# Altium schematic sheet DC_DRIVERS.SchDoc
size A4; SheetNumber: 2; SheetTotal: 7
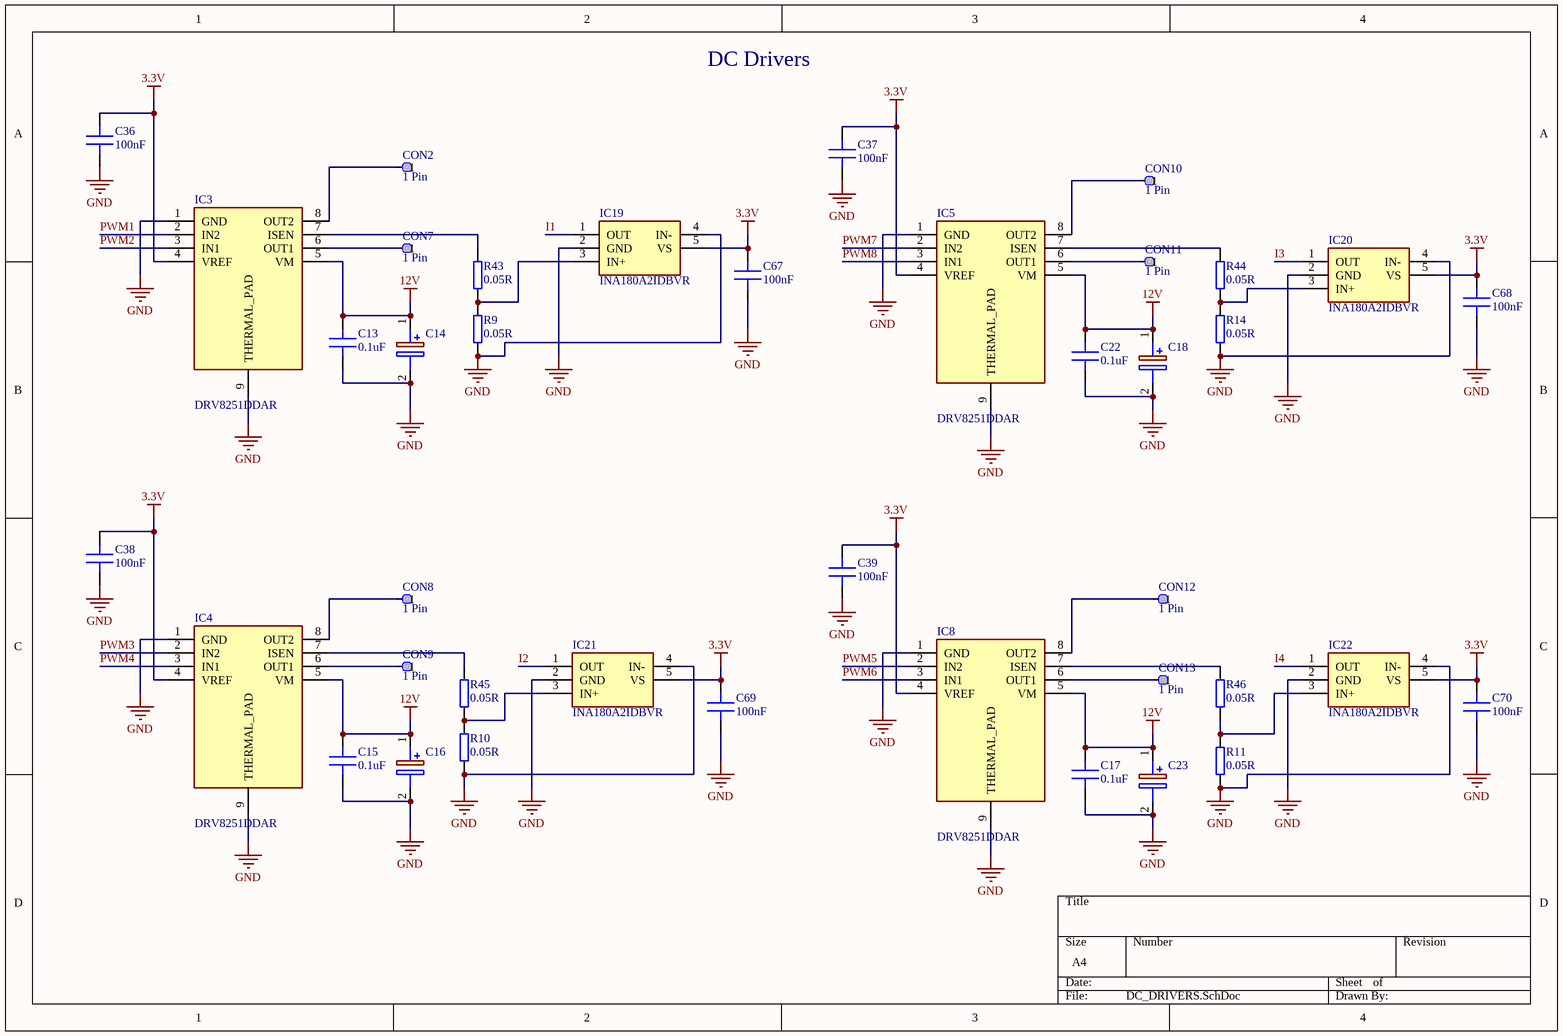
[diagram p0: DC_DRIVERS.SchDoc]

## Parts
C13  0.1uF  [C 0402]
C14  UVY1V101MED1TD  [CAPPRD250W50D655H1250]  (value not drawn)
C15  0.1uF  [C 0603]
C16  UVY1V101MED1TD  [CAPPRD250W50D655H1250]  (value not drawn)
C17  0.1uF  [C 0402]
C18  UVY1V101MED1TD  [CAPPRD250W50D655H1250]  (value not drawn)
C22  0.1uF  [C 0402]
C23  UVY1V101MED1TD  [CAPPRD250W50D655H1250]  (value not drawn)
C36  100nF  [C 0402]
C37  100nF  [C 0402]
C38  100nF  [C 0402]
C39  100nF  [C 0402]
C67  100nF  [C 0402]
C68  100nF  [C 0402]
C69  100nF  [C 0402]
C70  100nF  [C 0402]
CON2  1 Pin  [SMD PAD]
CON7  1 Pin  [SMD PAD]
CON8  1 Pin  [SMD PAD]
CON9  1 Pin  [SMD PAD]
CON10  1 Pin  [SMD PAD]
CON11  1 Pin  [SMD PAD]
CON12  1 Pin  [SMD PAD]
CON13  1 Pin  [SMD PAD]
IC3  DRV8251DDAR  [SOIC127P600X170-9N]
IC4  DRV8251DDAR  [SOIC127P600X170-9N]
IC5  DRV8251DDAR  [SOIC127P600X170-9N]
IC8  DRV8251DDAR  [SOIC127P600X170-9N]
IC19  INA180A2IDBVR  [SOT95P280X145-5N]
IC20  INA180A2IDBVR  [SOT95P280X145-5N]
IC21  INA180A2IDBVR  [SOT95P280X145-5N]
IC22  INA180A2IDBVR  [SOT95P280X145-5N]
R9  0.05R  [R 1206]
R10  0.05R  [R 1206]
R11  0.05R  [R 1206]
R14  0.05R  [R 1206]
R43  0.05R  [R 1206]
R44  0.05R  [R 1206]
R45  0.05R  [R 1206]
R46  0.05R  [R 1206]

## Nets
3.3V: C36.1 C37.1 C38.1 C39.1 C67.1 C68.1 C69.1 C70.1 IC3.4(VREF) IC4.4(VREF) IC5.4(VREF) IC8.4(VREF) IC19.5(VS) IC20.5(VS) IC21.5(VS) IC22.5(VS)
12V: C13.1 C14.1(+) C15.1 C16.1(+) C17.1 C18.1(+) C22.1 C23.1(+) IC3.5(VM) IC4.5(VM) IC5.5(VM) IC8.5(VM)
GND: C13.2 C14.2(-) C15.2 C16.2(-) C17.2 C18.2(-) C22.2 C23.2(-) C36.2 C37.2 C38.2 C39.2 C67.2 C68.2 C69.2 C70.2 IC3.1(GND) IC3.9(THERMAL_PAD) IC4.1(GND) IC4.9(THERMAL_PAD) IC5.1(GND) IC5.9(THERMAL_PAD) IC8.1(GND) IC8.9(THERMAL_PAD) IC19.2(GND) IC19.4(IN-) IC20.2(GND) IC20.4(IN-) IC21.2(GND) IC21.4(IN-) IC22.2(GND) IC22.4(IN-) R9.2 R10.2 R11.2 R14.2
I1: IC19.1(OUT)
I2: IC21.1(OUT)
I3: IC20.1(OUT)
I4: IC22.1(OUT)
PWM1: IC3.2(IN2)
PWM2: IC3.3(IN1)
PWM3: IC4.2(IN2)
PWM4: IC4.3(IN1)
PWM5: IC8.2(IN2)
PWM6: IC8.3(IN1)
PWM7: IC5.2(IN2)
PWM8: IC5.3(IN1)
NetCON2_1: CON2.1 IC3.8(OUT2)
NetCON7_1: CON7.1 IC3.6(OUT1)
NetCON8_1: CON8.1 IC4.8(OUT2)
NetCON9_1: CON9.1 IC4.6(OUT1)
NetCON10_1: CON10.1 IC5.8(OUT2)
NetCON11_1: CON11.1 IC5.6(OUT1)
NetCON12_1: CON12.1 IC8.8(OUT2)
NetCON13_1: CON13.1 IC8.6(OUT1)
NetIC3_7: IC3.7(ISEN) R43.1
NetIC4_7: IC4.7(ISEN) R45.1
NetIC5_7: IC5.7(ISEN) R44.1
NetIC8_7: IC8.7(ISEN) R46.1
NetIC19_3: IC19.3(IN+) R9.1 R43.2
NetIC20_3: IC20.3(IN+) R14.1 R44.2
NetIC21_3: IC21.3(IN+) R10.1 R45.2
NetIC22_3: IC22.3(IN+) R11.1 R46.2

## Notes on the sheet
- DC Drivers

## Library data of the parts
C13 C15 C17 C22 C36-C39 C67-C70 = Capacitor: MLCC Capacitor
C14 C16 C18 C23 = UVY1V101MED1TD: Capacitor Polarised; Manufacturer_Name: Nichicon; Datasheet Link: http://nichicon-us.com/english/products/pdfs/e-uvy.pdf; Height: 12.5mm; Manufacturer_Part_Number: UVY1V101MED1TD; Arrow Part Number: UVY1V101MED1TD; Arrow Price/Stock: https://www.arrow.com/en/products/uvy1v101med1td/nichicon
IC3-IC5 IC8 = DRV8251DDAR: Integrated Circuit; Manufacturer_Name: Texas Instruments; Datasheet Link: https://www.arrow.com/en/products/drv8251ddar/texas-instruments?region=nac; Height: 1.7mm; Manufacturer_Part_Number: DRV8251DDAR; Mouser Part Number: 595-DRV8251DDAR; Mouser Price/Stock: https://www.mouser.co.uk/ProductDetail/Texas-Instruments/DRV8251DDAR?qs=doiCPypUmgHTzZyfapGahQ%3D%3D; Arrow Part Number: DRV8251DDAR; Arrow Price/Stock: https://www.arrow.com/en/products/drv8251ddar/texas-instruments?region=nac
IC19-IC22 = INA180A2IDBVR: Integrated Circuit; Manufacturer_Name: Texas Instruments; Datasheet Link: http://www.ti.com/lit/ds/symlink/ina180.pdf; Height: 1.45mm; Manufacturer_Part_Number: INA180A2IDBVR; Mouser Part Number: 595-INA180A2IDBVR; Mouser Price/Stock: https://www.mouser.co.uk/ProductDetail/Texas-Instruments/INA180A2IDBVR?qs=5aG0NVq1C4wYcJfa99BoHg%3D%3D; Arrow Part Number: INA180A2IDBVR; Arrow Price/Stock: https://www.arrow.com/en/products/ina180a2idbvr/texas-instruments?utm_currency=USD&region=nac
R9-R11 R14 R43-R46 = Resistor: General pourpouse resistor